# EAGLE design SENSORY_BRIDGE (EAGLE 9.5.1)
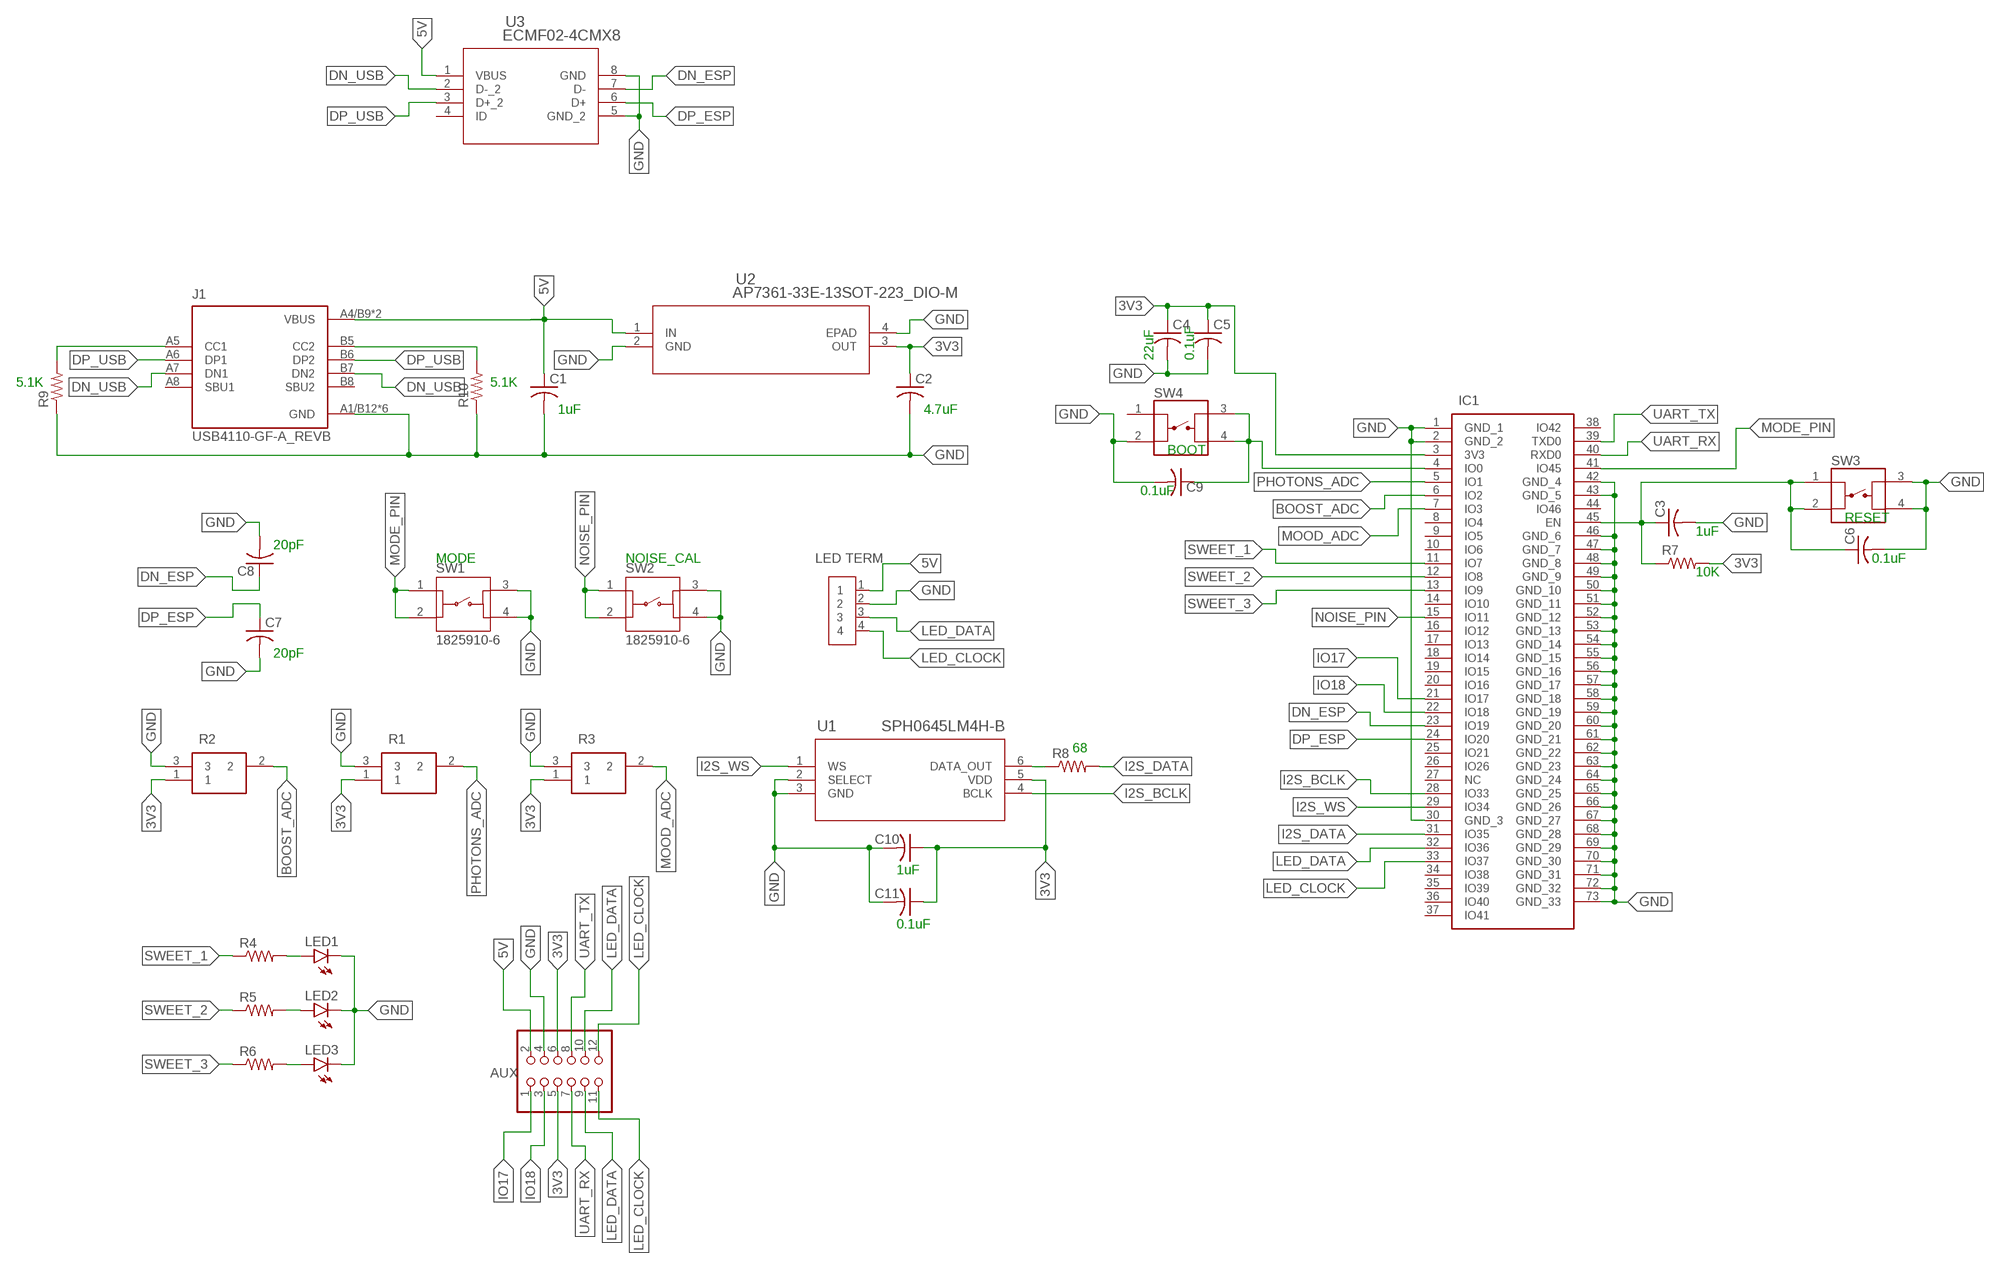
[diagram p0: schematic, sheet 1]

## Parts
C1  C-USC0805K  [C0805K]
C2  C-USC0805K  [C0805K]
C3  C-USC0805K  [C0805K]
C4  C-USC0805K  [C0805K]
C5  C-USC0805K  [C0805K]
C6  C-USC0805K  [C0805K]
C7  C-USC0805K  [C0805K]
C8  C-USC0805K  [C0805K]
C9  C-USC0805K  [C0805K]
C10  C-USC0805K  [C0805K]
C11  C-USC0805K  [C0805K]
IC1  ESP32-S2-MINI-1-N4R2  [ESP32S2MINI1N4R2]
J1  USB4110-GF-A_REVB  [GCT_USB4110-GF-A_REVB]
J2  796949-4  [TE_796949-4]
JP1  PINHD-2X6  [2X06]
LED1  LED3MM  [LED3MM]
LED2  LED3MM  [LED3MM]
LED3  LED3MM  [LED3MM]
R1  3386P-1-103LF  [3386P_1]
R2  3386P-1-103LF  [3386P_1]
R3  3386P-1-103LF  [3386P_1]
R4  R-US_R0805  [R0805]
R5  R-US_R0805  [R0805]
R6  R-US_R0805  [R0805]
R7  R-US_R0805  [R0805]
R8  R-US_R0805  [R0805]
R9  R-US_R0805  [R0805]
R10  R-US_R0805  [R0805]
SW1  1825910-6  [SW_1825910-6-4]
SW2  1825910-6  [SW_1825910-6-4]
SW3  PTS525SM15SMTR2LFS  [SW_PTS525SM15SMTR2LFS]
SW4  PTS525SM15SMTR2LFS  [SW_PTS525SM15SMTR2LFS]
U1  SPH0645LM4H-B  [SPH0645LM4H-B_KNO]
U2  AP7361-33E-13SOT-223_DIO-M  [SOT-223_DIO-M]
U3  ECMF02-4CMX8  [MICRO_QFN-8L_STM]

## Nets
3V3: C2.1 C4.1 C5.1 C10.1 C11.1 IC1.3(3V3) JP1.5 JP1.6 R1.1 R2.1 R3.1 R7.2 U1.5(VDD) U2.3(OUT)
5V: C1.1 J1.A4/B9(VBUS) J1.B4/A9(VBUS) J2.1 JP1.2 U2.1(IN) U3.1(VBUS)
BOOST_ADC: IC1.6(IO2) R2.2
BOOT_LINE: C9.1 IC1.4(IO0) SW4.3 SW4.4
CC1: J1.A5(CC1) R9.2
CC2: J1.B5(CC2) R10.2
DN_ESP: C8.1 IC1.23(IO19) U3.7(D-)
DN_USB: J1.A7(DN1) J1.B7(DN2) U3.2(D-_2)
DP_ESP: C7.1 IC1.24(IO20) U3.6(D+)
DP_USB: J1.A6(DP1) J1.B6(DP2) U3.3(D+_2)
GND: C1.2 C2.2 C3.2 C4.2 C5.2 C6.2 C7.2 C8.2 C9.2 C10.2 C11.2 IC1.1(GND_1) IC1.2(GND_2) IC1.30(GND_3) IC1.42(GND_4) IC1.43(GND_5) IC1.46(GND_6) IC1.47(GND_7) IC1.48(GND_8) IC1.49(GND_9) IC1.50(GND_10) IC1.51(GND_11) IC1.52(GND_12) IC1.53(GND_13) IC1.54(GND_14) IC1.55(GND_15) IC1.56(GND_16) IC1.57(GND_17) IC1.58(GND_18) IC1.59(GND_19) IC1.60(GND_20) IC1.61(GND_21) IC1.62(GND_22) IC1.63(GND_23) IC1.64(GND_24) IC1.65(GND_25) IC1.66(GND_26) IC1.67(GND_27) IC1.68(GND_28) IC1.69(GND_29) IC1.70(GND_30) IC1.71(GND_31) IC1.72(GND_32) IC1.73(GND_33) J1.A1/B12(GND) J1.B1/A12(GND) J1.S1(GND) J1.S2(GND) J1.S3(GND) J1.S4(GND) J2.2 JP1.4 LED1.K(C) LED2.K(C) LED3.K(C) R1.3 R2.3 R3.3 R9.1 R10.1 SW1.3 SW1.4 SW2.3 SW2.4 SW3.3 SW3.4 SW4.2 U1.2(SELECT) U1.3(GND) U2.2(GND) U2.4(EPAD) U3.5(GND_2) U3.8(GND)
I2S_BCLK: IC1.28(IO33) U1.4(BCLK)
I2S_DATA: IC1.31(IO35) R8.2
I2S_WS: IC1.29(IO34) U1.1(WS)
IO17: IC1.21(IO17) JP1.1
IO18: IC1.22(IO18) JP1.3
LED_CLOCK: IC1.33(IO37) J2.4 JP1.11 JP1.12
LED_DATA: IC1.32(IO36) J2.3 JP1.9 JP1.10
MODE_PIN: IC1.41(IO45) SW1.1 SW1.2
MOOD_ADC: IC1.7(IO3) R3.2
N$2: R8.1 U1.6(DATA_OUT)
N$4: LED1.A R4.2
N$5: LED2.A R5.2
N$6: LED3.A R6.2
NOISE_PIN: IC1.15(IO11) SW2.1 SW2.2
PHOTONS_ADC: IC1.5(IO1) R1.2
RESET_LINE: C3.1 C6.1 IC1.45(EN) R7.1 SW3.1 SW3.2
SWEET_1: IC1.11(IO7) R4.1
SWEET_2: IC1.12(IO8) R5.1
SWEET_3: IC1.13(IO9) R6.1
UART_RX: IC1.40(RXD0) JP1.7
UART_TX: IC1.39(TXD0) JP1.8
Unconnected: IC1.8(IO4) IC1.9(IO5) IC1.10(IO6) IC1.14(IO10) IC1.16(IO12) IC1.17(IO13) IC1.18(IO14) IC1.19(IO15) IC1.20(IO16) IC1.25(IO21) IC1.26(IO26) IC1.27(NC) IC1.34(IO38) IC1.35(IO39) IC1.36(IO40) IC1.37(IO41) IC1.38(IO42) IC1.44(IO46) J1.A8(SBU1) J1.B8(SBU2) SW4.1 U3.4(ID)

## Notes on the sheet
- 22uF | 0.1uF
- 5.1K | 5.1K
- 1uF | 4.7uF
- BOOT
- 0.1uF
- RESET
- 1uF
- 20pF
- MODE | NOISE_CAL | LED TERM | 0.1uF
- 10K
- 20pF
- 68
- 1uF
- 0.1uF
- AUX

## Library data of the parts
C1-C11 = adafruit:C-US: CAPACITOR, American symbol
IC1 = SamacSys_Parts:ESP32-S2-MINI-1-N4R2: WiFi Modules - 802.11 SMD module, ESP32-S2FN4R2 with 4 MB flash die and 2 MB PSRAM die inside, PCB antenna Source: Datasheet; DESCRIPTION: WiFi Modules - 802.11 SMD module, ESP32-S2FN4R2 with 4 MB flash die and 2 MB PSRAM die inside, PCB antenna; HEIGHT: 2.55mm; MANUFACTURER_NAME: Espressif Systems; MANUFACTURER_PART_NUMBER: ESP32-S2-MINI-1-N4R2; MOUSER_PART_NUMBER: 356-ESP32S2MINI1N4R2; MOUSER_PRICE-STOCK: https://www.mouser.co.uk/ProductDetail/Espressif-Systems/ESP32-S2-MINI-1-N4R2?qs=iLbezkQI%252Bsgb61FCBnw%252B9A%3D%3D
J1 = USB4110-GF-A_REVB:USB4110-GF-A_REVB; DESCRIPTION: USB-C (USB TYPE-C) USB 2.0 Receptacle Connector 24 (16+8 Dummy) Position Surface Mount, Right Angle; Through Hole; DIGI-KEY_PART_NUMBER: 2073-USB4110-GF-A-1-ND; MF: GCT; MP: USB4110-GF-A; PACKAGE: None; PURCHASE-URL: https://pricing.snapeda.com/search/part/USB4110-GF-A/?ref=eda
J2 = screw_terminal_796949-4:796949-4: Wire to Board 4 Position 5.08 mm Pitch 30-12 AWG Euro Style Terminal Block; COMMENT: 796949-4; DESCRIPTION: 4 Position Wire to Board Terminal Block Horizontal with Board 0.200 (5.08mm) Through Hole; DIGI-KEY_PART_NUMBER: 796949-4-ND; MF: TE Connectivity; MP: 796949-4; PACKAGE: None; PURCHASE-URL: https://pricing.snapeda.com/search/part/796949-4/?ref=eda
JP1 = pinhead:PINHD-2X6: PIN HEADER
LED1-LED3 = led_3mm_better:LED: LED OSRAM: - CHIPLED LG R971, LG N971, LY N971, LG Q971, LY Q971, LO R971, LY R971 LH N974, LH R974 LS Q976, LO Q976, LY Q976 LO Q996 - Hyper CHIPLED LW Q18S LB Q993, LB Q99A, LB R99A - SideLED LS A670, LO A670, LY A670, LG A670, LP A670 LB A673, LV A673, LT A673, LW A673 LH A674 LY A675 LS A676, LA A676, LO A676, LY A676, LW A676 LS A679, LY A679, LG A679 - Hyper Micro SIDELED® LS Y876, LA Y876, LO Y876, LY Y876 LT Y87S - SmartLED LW L88C, LW L88S LB L89C, LB L89S, LG L890 LS L89K, LO L89K, LY L89K LS L896, LA L896, LO L896, LY L896 - TOPLED LS T670, LO T670, LY T670, LG T670, LP T670 LSG T670, LSP T670, LSY T670, LOP T670, LYG T670 LG T671, LOG T671, LSG T671 LB T673, LV T673, LT T673, LW T673 LH T674 LS T676, LA T676, LO T676, LY T676, LB T676, LH T676, LSB T676, LW T676 LB T67C, LV T67C, LT T67C, LS T67K, LO T67K, LY T67K, LW E67C LS E67B, LA E67B, LO E67B, LY E67B, LB E67C, LV E67C, LT E67C LW T67C LS T679, LY T679, LG T679 LS T770, LO T770, LY T770, LG T770, LP T770 LB T773, LV T773, LT T773, LW T773 LH T774 LS E675, LA E675, LY E675, LS T675 LS T776, LA T776, LO T776, LY T776, LB T776 LHGB T686 LT T68C, LB T68C - Hyper Mini TOPLED® LB M676 - Mini TOPLED Santana® LG M470 LS M47K, LO M47K, LY M47K Source: http://www.osram.convergy.de LUXEON: - LUMILED® LXK2-PW12-R00, LXK2-PW12-S00, LXK2-PW14-U00, LXK2-PW14-V00 LXK2-PM12-R00, LXK2-PM12-S00, LXK2-PM14-U00 LXK2-PE12-Q00, LXK2-PE12-R00, LXK2-PE12-S00, LXK2-PE14-T00, LXK2-PE14-U00 LXK2-PB12-K00, LXK2-PB12-L00, LXK2-PB12-M00, LXK2-PB14-N00, LXK2-PB14-P00, LXK2-PB14-Q00 LXK2-PR12-L00, LXK2-PR12-M00, LXK2-PR14-Q00, LXK2-PR14-R00 LXK2-PD12-Q00, LXK2-PD12-R00, LXK2-PD12-S00 LXK2-PH12-R00, LXK2-PH12-S00 LXK2-PL12-P00, LXK2-PL12-Q00, LXK2-PL12-R00 Source: www.luxeon.com KINGBRIGHT: KA-3528ASYC Source: www.kingbright.com
R1-R3 = 3386P-1-103LF:3386P-1-103LF: Bourns 3386P Series Through Hole Trimmer Resistor with Pin Terminations, 10k +/-10% 1/2W +/-100ppm/C Top Adjust Source: Datasheet <https://www.bourns.com/pdfs/3386.pdf>; DESCRIPTION: Bourns 3386P Series Through Hole Trimmer Resistor with Pin Terminations, 10k +/-10% 1/2W +/-100ppm/C Top Adjust; HEIGHT: mm; MANUFACTURER_NAME: Bourns; MANUFACTURER_PART_NUMBER: 3386P-1-103LF; MOUSER_PART_NUMBER: 652-3386P-1-103LF; MOUSER_PRICE-STOCK: https://www.mouser.co.uk/ProductDetail/Bourns/3386P-1-103LF?qs=m2uG%2FFdTAPWTJ6kNGJOVuA%3D%3D
R4-R10 = adafruit:R-US_: RESISTOR, American symbol
SW1 SW2 = 6mm_tact_switch_1825910-6:1825910-6: Switch Tactile OFF (ON) SPST Round Button PC Pins 0.05A 24VDC 100000Cycles 1.57N Thru-Hole Loose; COMMENT: 1825910-6; DESCRIPTION: Switch Push Button OFF (ON) SPST Round Button 0.05A 24VDC Momentary Contact PC Pins Thru-Hole; DIGI-KEY_PART_NUMBER: 450-1650-ND; MF: TE Connectivity; MP: 1825910-6; PACKAGE: None; PURCHASE-URL: https://pricing.snapeda.com/search/part/1825910-6/?ref=eda
SW3 SW4 = PTS525SM15SMTR2LFS:PTS525SM15SMTR2LFS: Switch Tactile N.O. SPST Round Button Gull Wing 0.02A 15VDC 1000000Cycles 1.569N SMD T/R; DESCRIPTION: Tactile Switch SPST-NO Top Actuated Surface Mount; DIGI-KEY_PART_NUMBER: CKN9104CT-ND; MF: C&K; MP: PTS525SM15SMTR2 LFS; PACKAGE: Tactile Switch CK; PURCHASE-URL: https://pricing.snapeda.com/search/part/PTS525SM15SMTR2 LFS/?ref=eda
U1 = SPH0645LM4H-B:SPH0645LM4H-B; COPYRIGHT: Copyright (C) 2022 Ultra Librarian. All rights reserved.; DIGI-KEY_PART_NUMBER_1: 423-1405-2-ND; DIGI-KEY_PART_NUMBER_2: 423-1405-1-ND; DIGI-KEY_PART_NUMBER_3: 423-1405-6-ND; MANUFACTURER_PART_NUMBER: SPH0645LM4H-B; MFR_NAME: Knowles
U2 = 3V3_Regulator_AP7361-33E-13:AP7361-33E-13; COPYRIGHT: Copyright (C) 2022 Ultra Librarian. All rights reserved.; DIGI-KEY_PART_NUMBER_1: AP7361-33E-13DICT-ND; DIGI-KEY_PART_NUMBER_2: AP7361-33E-13DIDKR-ND; DIGI-KEY_PART_NUMBER_3: AP7361-33E-13DITR-ND; MANUFACTURER_PART_NUMBER: AP7361-33E-13; MFR_NAME: Diodes Inc
U3 = ECMF02-4CMX8_USB_ESD_IC:ECMF02-4CMX8; COPYRIGHT: Copyright (C) 2022 Ultra Librarian. All rights reserved.; DIGI-KEY_PART_NUMBER_1: 497-13420-2-ND; DIGI-KEY_PART_NUMBER_2: 497-13420-1-ND; DIGI-KEY_PART_NUMBER_3: 497-13420-6-ND; MANUFACTURER_PART_NUMBER: ECMF02-4CMX8; MFR_NAME: STMicroelectronics

## Board
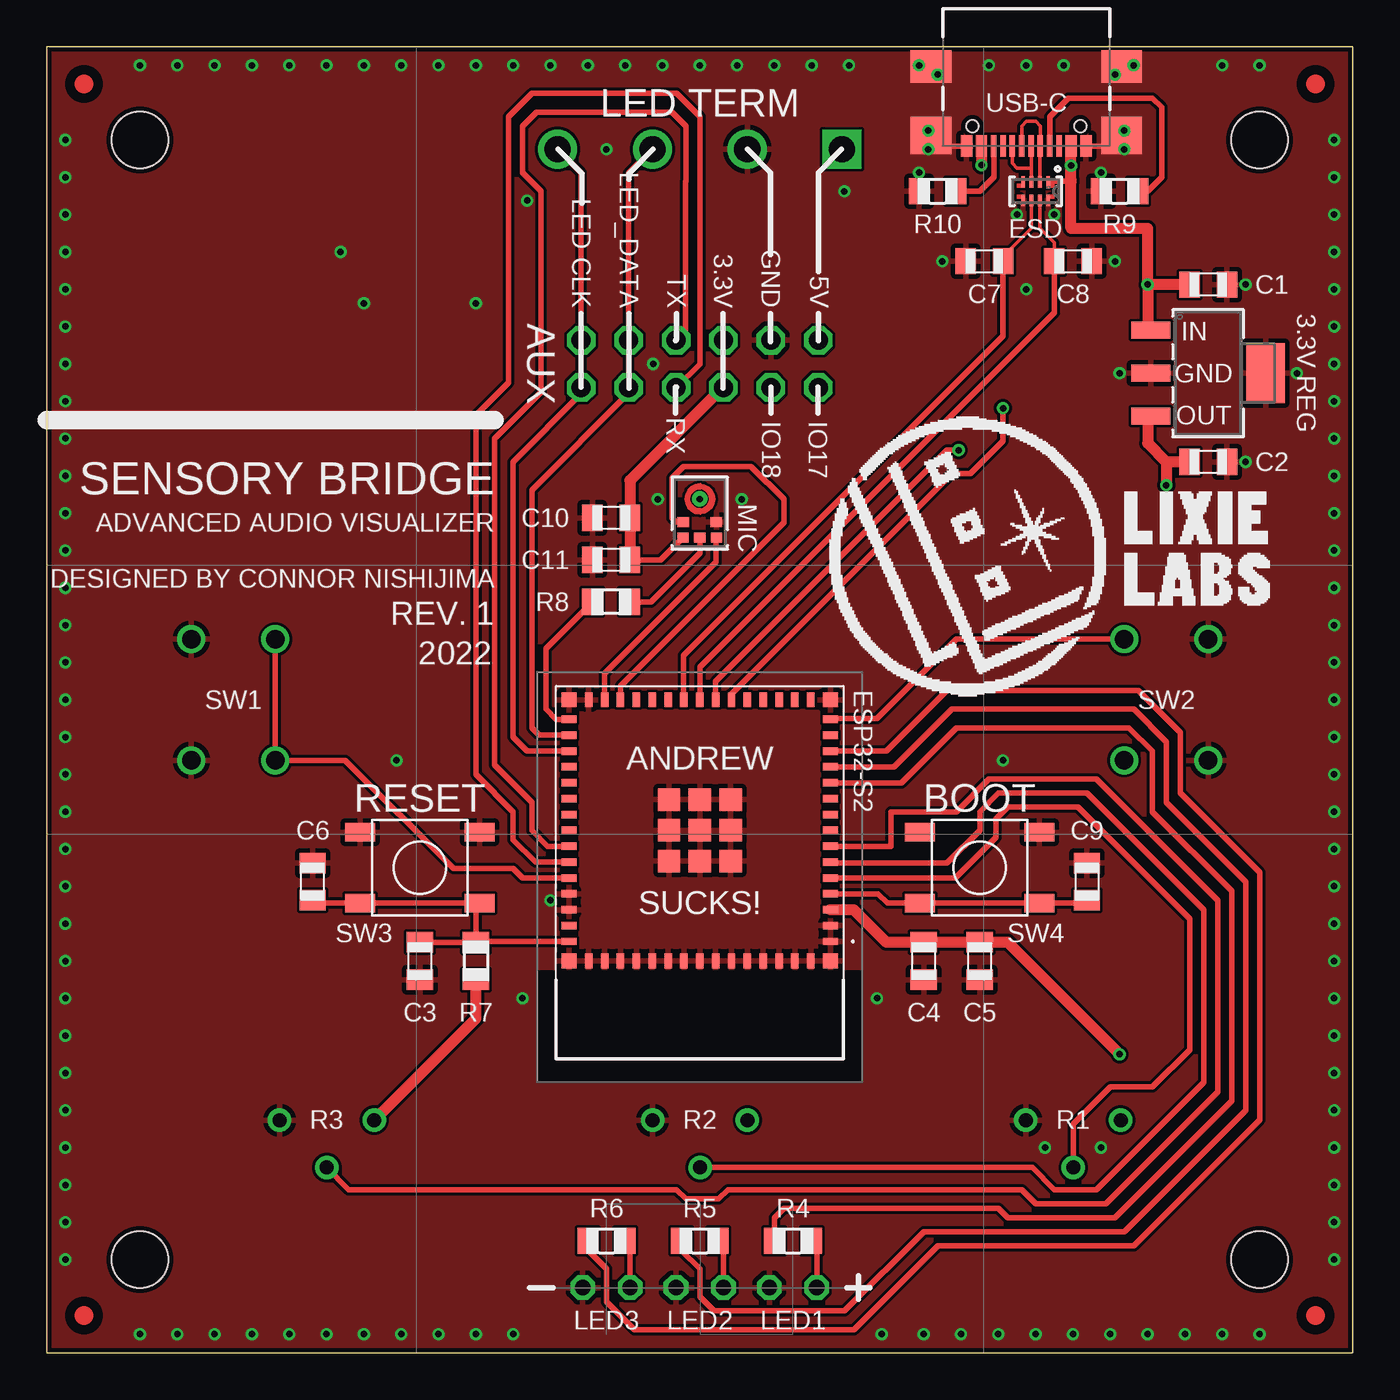
[diagram p1: board, top side]
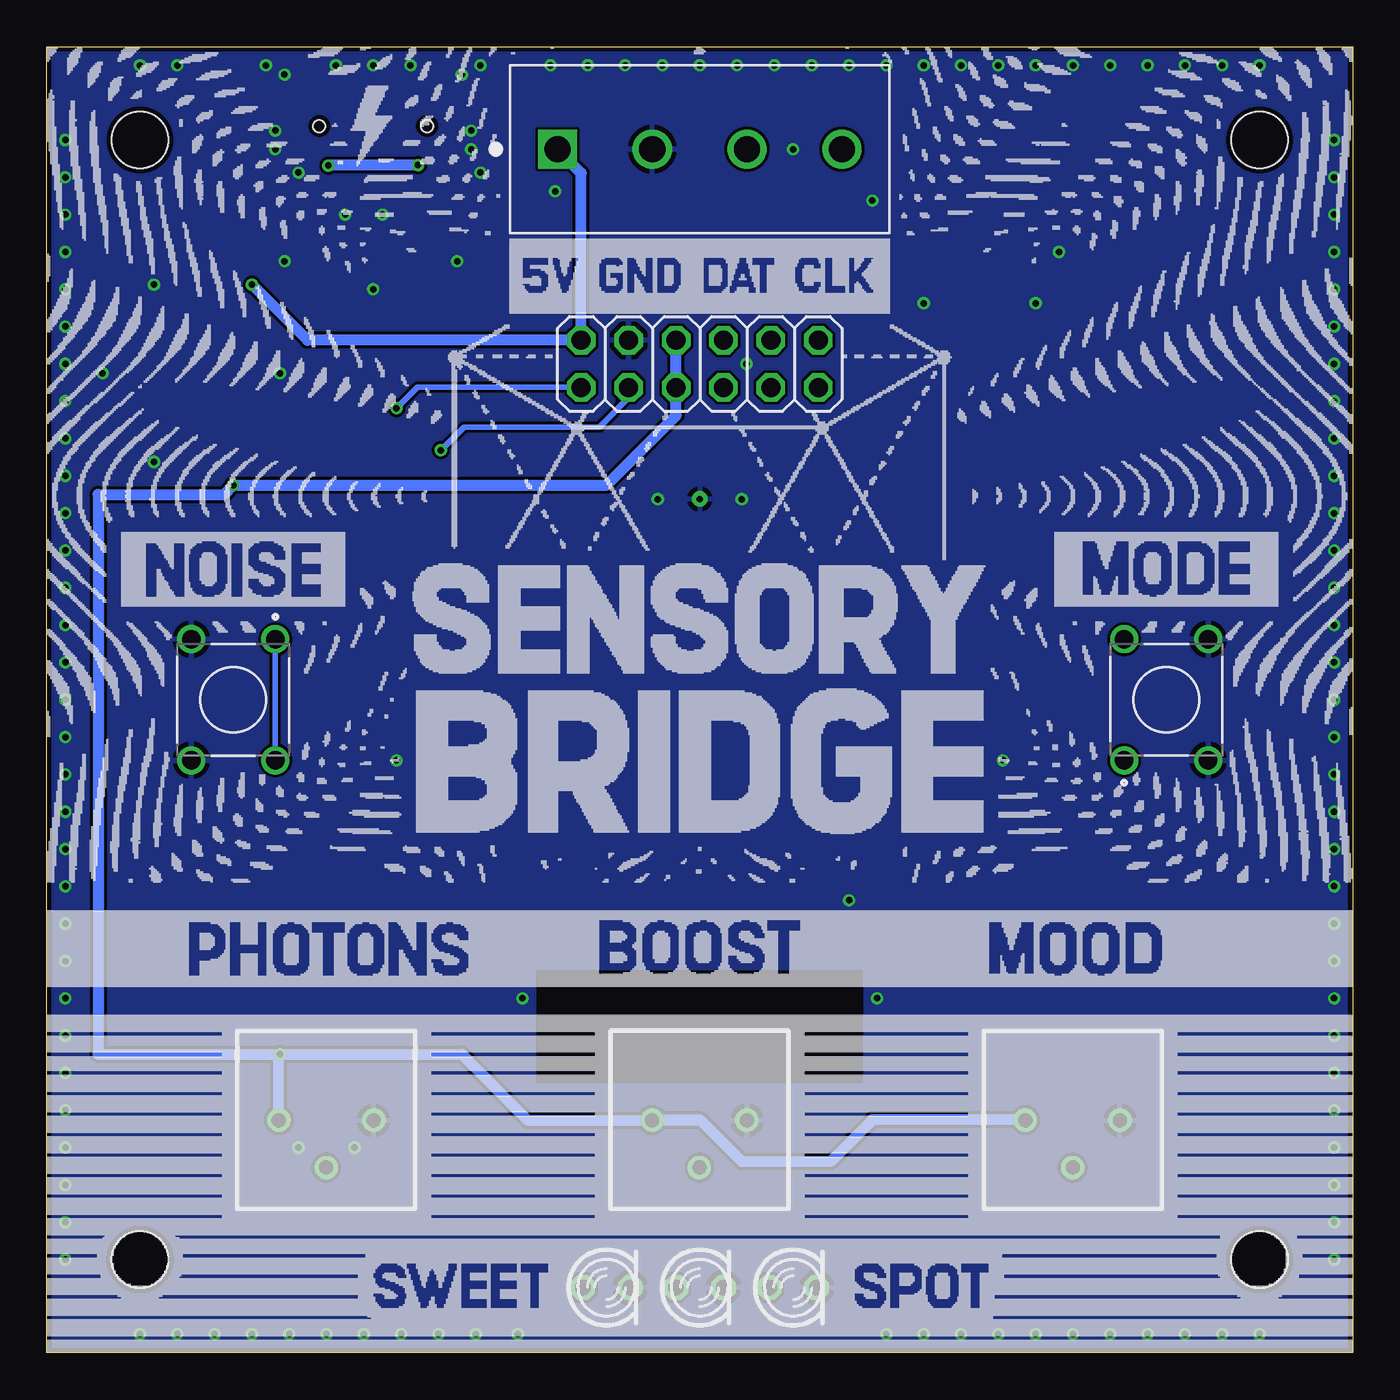
[diagram p2: board, bottom side, seen from below]

Size 70 x 70 mm. Coordinates in mm from the lower left corner, seen from the top.
Outline: 0,0 70,0 70,70 0,70 0,0
Copper layers (1*16): Top 0.035mm / dielectric 1.5mm / Bottom 0.035mm
Design rules "dirt_cheap_dirty_boards.v1.1": minimum track width 6mil, minimum drill 12mil, track to track 6mil, track to pad 6mil, pad to pad 6mil, via to via 6mil, smd to smd 0mil, copper to edge 10mil, drill to drill 10mil, minimum pad ring 10mil, minimum via ring 6mil, stop-mask expansion 2mil, vias tented up to drill 25mil, thermal gap 10mil
Holes 3.05 mm at 5,65 65,65 5,5 65,5
tRestrict: area 26.2,14.5 to 43.8,20.5
bRestrict: area 26.2,14.5 to 43.8,20.5

### Footprints (pad centres in the part's own frame; a part is rotated, then mirrored left to right if it is on the bottom)
C0805K = smd 1.1 x 1.4: 1 -1,0; 2 1,0
ESP32S2MINI1N4R2 = smd 0.8 x 0.4: 1 -7,5.95; 2 -7,5.1; 3 -7,4.25; 4 -7,3.4; 5 -7,2.55; 6 -7,1.7; 7 -7,0.85; 8 -7,0; 9 -7,-0.85; 10 -7,-1.7; 11 -7,-2.55; 12 -7,-3.4; 13 -7,-4.25; 14 -7,-5.1; 15 -7,-5.95; 31 7,-5.95; 32 7,-5.1; 33 7,-4.25; 34 7,-3.4; 35 7,-2.55; 36 7,-1.7; 37 7,-0.85; 38 7,0; 39 7,0.85; 40 7,1.7; 41 7,2.55; 42 7,3.4; 43 7,4.25; 44 7,5.1; 45 7,5.95 | smd 0.4 x 0.8: 16 -5.95,-7; 17 -5.1,-7; 18 -4.25,-7; 19 -3.4,-7; 20 -2.55,-7; 21 -1.7,-7; 22 -0.85,-7; 23 0,-7; 24 0.85,-7; 25 1.7,-7; 26 2.55,-7; 27 3.4,-7; 28 4.25,-7; 29 5.1,-7; 30 5.95,-7; 46 5.95,7; 47 5.1,7; 48 4.25,7; 49 3.4,7; 50 2.55,7; 51 1.7,7; 52 0.85,7; 53 0,7; 54 -0.85,7; 55 -1.7,7; 56 -2.55,7; 57 -3.4,7; 58 -4.25,7; 59 -5.1,7; 60 -5.95,7 | smd 1.2 x 1.2: 61 0,0; 66 -1.65,1.65; 67 -1.65,0; 68 -1.65,-1.65; 69 0,-1.65; 70 1.65,-1.65; 71 1.65,0; 72 1.65,1.65; 73 0,1.65 | smd 0.8 x 0.8: 62 -7,7; 63 -7,-7; 64 7,-7; 65 7,7
GCT_USB4110-GF-A_REVB = smd 0.6 x 1.15: A1/B12 -3.2,1.075; A4/B9 -2.4,1.075; B1/A12 3.2,1.075; B4/A9 2.4,1.075 | smd 0.3 x 1.15: A5 -1.25,1.075; A6 -0.25,1.075; A7 0.25,1.075; A8 1.25,1.075; B5 1.75,1.075; B6 0.75,1.075; B7 -0.75,1.075; B8 -1.75,1.075 | smd 2.18 x 2: S1 -5.11,0.5; S2 5.11,0.5 | smd 2.18 x 1.75: S3 -5.11,-3.18; S4 5.11,-3.18 | hole 0.65: -2.89,0; 2.89,0
TE_796949-4 = drill 1.4 square: 1 0,0 | drill 1.4: 2 5.08,0; 3 10.16,0; 4 15.24,0
2X06 = drill 1.016 octagon: 1 -6.35,-1.27; 2 -6.35,1.27; 3 -3.81,-1.27; 4 -3.81,1.27; 5 -1.27,-1.27; 6 -1.27,1.27; 7 1.27,-1.27; 8 1.27,1.27; 9 3.81,-1.27; 10 3.81,1.27; 11 6.35,-1.27; 12 6.35,1.27
LED3MM = drill 0.813 octagon: A -1.27,0; K 1.27,0
3386P_1 = drill 0.75 pad 1.25: 1 7.305,4.78; 2 4.765,7.32; 3 2.225,4.78
R0805 = smd 1.1 x 1.4: 1 -1,0; 2 1,0
SW_1825910-6-4 = drill 0.99: 1 -3.25,2.25; 2 3.25,2.25; 3 -3.25,-2.25; 4 3.25,-2.25
SW_PTS525SM15SMTR2LFS = smd 1.6 x 1: 1 -3.2,1.9; 2 3.2,1.9; 3 -3.2,-1.9; 4 3.2,-1.9
SPH0645LM4H-B_KNO = smd 0.533 x 0.61: 1 1.311,0.9; 2 0.489,0.889; 4 0.489,-0.889; 5 1.311,-0.9; 6 1.311,0 | drill 0.33 pad 0.33: 3 -0.762,0
SOT-223_DIO-M = smd 0.902 x 2.066: 1 -2.3,-3.076; 2 0,-3.076; 3 2.3,-3.076 | smd 3.202 x 2.066: 4 0,3.076
MICRO_QFN-8L_STM = smd 0.61 x 0.203: 1 -0.5,0.675; 2 -0.5,0.225; 3 -0.5,-0.225; 4 -0.5,-0.675; 5 0.5,-0.675; 6 0.5,-0.225; 7 0.5,0.225; 8 0.5,0.675

### Placement (x,y rotation side)
C1  62.25,57.25 0 top
C2  62.25,47.75 0 top
C3  20,21 270 top
C4  47,21 270 top
C5  50,21 270 top
C6  14.25,25.25 90 top
C7  50.25,58.5 180 top
C8  55,58.5 0 top
C9  55.75,25.25 90 top
C10  30.25,44.75 180 top
C11  30.25,42.5 180 top
IC1  35,28 180 top
J1  52.5,65.75 180 top
J2  42.62,64.5 0 bottom
JP1  35,53 0 bottom
LED1  40,3.5 0 bottom
LED2  35,3.5 0 bottom
LED3  30,3.5 0 bottom
R1  50.25,17.25 180 bottom
R2  30.25,17.25 180 bottom
R3  10.25,17.25 180 bottom
R4  40,6 0 top
R5  35,6 0 top
R6  30,6 0 top
R7  23,21 270 top
R8  30.25,40.25 180 top
R9  57.5,62.25 0 top
R10  47.75,62.25 0 top
SW1  10,35 90 bottom
SW2  60,35 270 bottom
SW3  20,26 180 top
SW4  50,26 0 top
U1  35,45 270 top
U2  62.25,52.5 270 top
U3  53,62.25 270 top
U$1  [CIRCLE-1MM-2R]  2,68 0 top
U$2  [CIRCLE-1MM-2R]  68,68 0 top
U$3  [CIRCLE-1MM-2R]  2,2 0 top
U$4  [CIRCLE-1MM-2R]  68,2 0 top

### Tracks (layer width: path | path; a pad name or v marks a point on that pad's centre or on a via)
3V3  (via drill 0.35 pad 0.6)
  Top 0.3: U1.5 32.91,42.5 C11.1
  Top 0.6: C2.1 60,47.75 | 60,47.75 59,48.75 59,50.03 U2.3 | 60,47.75 v60,46.5 | IC1.3 43.25,23.75 45,22 C4.1 C5.1 51.5,22 v57.5,16 | JP1.5 36.23,51.73 31.25,46.75 C10.1 C11.1 | R3.1 23,17.91 R7.2
  Bottom 0.6: R1.1 57.55,15.97 57.52,16 | 57.52,16 67.25,16 67.25,46 60.5,46 v60,46.5 40,46.5 36.27,50.23 JP1.5 JP1.6 | 57.52,16 v57.5,16 47.75,16 44.22,12.47 R2.1 34.97,12.47 32.75,10.25 28,10.25 25.75,12.5 17.55,12.5 R3.1
5V  (via drill 0.35)
  Top 0.2: 54.9,62.75 U3.1 53.77,62.85 54.9,62.85
  Top 0.6: J1.B4/A9 v50.1,63.65 | v59,57.25 59,54.8 U2.1 | C1.1 v59,57.25 | v59,57.25 59,60.25 54.9,60.25 54.9,62.75 54.9,62.85 v54.9,63.62 J1.A4/B9
  Bottom 0.6: J2.1 41.35,63.23 JP1.2 56.02,54.27 v59,57.25 | v50.1,63.65 54.88,63.65 54.88,63.62 v54.9,63.62
BOOST_ADC
  Top 0.3: IC1.6 42.05,26.25 48.25,26.25 50,28 50,29 51,30 55.75,30 62,23.75 62,14.5 56.25,8.75 54,8.75 52.82,9.93 R2.2
BOOT_LINE
  Top 0.3: IC1.4 44.55,24.6 45.05,24.1 SW4.3 SW4.4 55.6,24.1 C9.1
CC1
  Top 0.3: J1.A5 53.75,66.25 54.75,67.25 59.25,67.25 59.75,66.75 59.75,63 59,62.25 R9.2
CC2
  Top 0.3: J1.B5 50.75,63 50,62.25 R10.2
DN_ESP
  Top 0.2: U3.7 53.23,60.27 54,59.5 C8.1
  Top 0.3: IC1.23 35,36.75 54,55.75 C8.1
DN_USB
  Top 0.2: J1.A7 52.25,65.75 52.5,66 53,66 53.25,65.75 J1.B7 53.23,64.65 U3.2
DP_ESP
  Top 0.2: U3.6 52.77,60.27 51.25,58.75 C7.1
  Top 0.3: IC1.24 34.12,35.02 34.12,37.38 51.25,54.5 C7.1
DP_USB
  Top 0.2: J1.B6 51.75,63.75 52,63.5 52.77,63.5 | J1.A6 52.77,64.65 52.77,63.5 | 52.77,63.5 U3.3
GND  (via drill 0.35, 0.35 pad 0.6)
  Top 0.3: J1.B1/A12 47.97,64.67 J1.S2 | J1.A1/B12 57.03,64.67 J1.S1
  other vias: 32.75,45.75 37.25,45.75 18.75,31.75 51.25,31.75 46.75,69 47.75,68.5 47.25,65.5 47.25,64.5 57.75,64.5 57.75,65.5 57.25,68.5 58.25,69 15.75,59 17,56.25 23,56.25 32.5,53 42.75,62.25 52.5,57 30,64.5 25.75,61.75 46.75,63.25 56.5,63.25 52,61 54,61 64.25,57.25 64.25,47.75 48,58.5 57.25,58.5 57.5,52.5 67,52.5 27,24.25 5,69 7,69 9,69 11,69 13,69 15,69 17,69 19,69 21,69 23,69 25,69 27,69 29,69 31,69 33,69 35,69 37,69 39,69 41,69 43,69 50.5,69 52.5,69 54.5,69 63,69 65,69 69,65 69,63 69,61 69,59 69,57 69,55 69,53 69,51 69,49 69,47 69,45 69,43 69,41 69,39 69,37 69,35 69,33 69,31 69,29 69,27 69,25 69,23 69,21 69,19 69,17 69,15 69,13 69,11 69,9 69,7 69,5 44.75,1 5,1 7,1 9,1 11,1 13,1 15,1 17,1 19,1 21,1 23,1 25,1 47,1 49,1 51,1 53,1 59,1 61,1 63,1 65,1 57,1 55,1 1,65 1,63 1,61 1,59 1,57 1,55 1,53 1,51 1,49 1,47 1,45 1,43 1,41 1,39 1,37 1,35 1,33 1,31 1,29 1,27 1,25 1,23 1,21 1,19 1,17 1,15 1,13 1,11 1,9 1,7 1,5 25.5,19 44.5,19 56.5,11 53.5,11
  pour Top: -1,-1 -1,71 71,71 71,-1
  pour Bottom: -1,-1 71,-1 71,71 -1,71
I2S_BCLK
  Top 0.3: U1.4 33.74,44.51 33.5,44.75 33.5,46.88 34.12,47.5 37.75,47.5 39.5,45.75 39.5,44.5 30.75,35.75 IC1.28
I2S_DATA
  Top 0.3: IC1.31 27.3,33.95 26.75,34.5 26.75,37.75 R8.2
I2S_WS
  Top 0.3: U1.1 35.88,43.66 35.88,42.38 29.9,36.4 IC1.29
IO17  (via drill 0.35 pad 0.6)
  Top 0.3: IC1.21 36.73,35.02 36.69,35.06 36.69,35.31 48.5,47.12 49.5,47.12 51.25,48.88 v51.25,50.62
  Bottom 0.3: v51.25,50.62 50.12,51.75 41.37,51.75 JP1.1
IO18  (via drill 0.35 pad 0.6)
  Top 0.3: IC1.22 35.85,35.98 48.25,48.38 v48.88,48.38
  Bottom 0.3: v48.88,48.38 47.62,49.62 40.38,49.62 38.81,51.19 JP1.3
LED_CLOCK
  Top 0.3: J2.4 28.65,63.23 JP1.12 JP1.11 28.65,51.4 25,47.75 25,33 25.75,32.25 IC1.33
LED_DATA
  Top 0.3: J2.3 31.19,63.23 JP1.10 JP1.9 31.19,51.44 26,46.25 26,33.5 26.4,33.1 IC1.32
MODE_PIN
  Top 0.3: IC1.41 25.5,25.45 25,25.95 21.8,25.95 16,31.75 SW1.1 SW1.2
MOOD_ADC
  Top 0.3: IC1.7 45.25,27.15 45.25,29 48.75,29 50.5,30.75 56.25,30.75 62.75,24.25 62.75,14 56.75,8 53,8 52.25,8.75 36.5,8.75 36,8.25 34.25,8.25 33.75,8.75 16.2,8.75 R3.2
N$2
  Top 0.3: U1.6 35,42.88 32.38,40.25 R8.1
N$4
  Top 0.3: LED1.A 41.27,5.73 R4.2
N$5
  Top 0.3: LED2.A 36.27,5.73 R5.2
N$6
  Top 0.3: LED3.A 31.27,5.73 R6.2
NOISE_PIN
  Top 0.3: IC1.15 42.05,34 44.5,34 48.75,38.25 SW2.1
  Bottom 0.3: SW2.2 SW2.1
PHOTONS_ADC
  Top 0.3: IC1.5 48.7,25.45 50.88,27.62 50.88,28.62 51.5,29.25 55.25,29.25 61.25,23.25 61.25,16.25 59.25,14.25 57,14.25 55.02,12.27 R1.2
RESET_LINE
  Top 0.3: IC1.45 23.05,22.05 R7.1 | R7.1 C3.1 | R7.1 23,23.9 SW3.1 SW3.2 14.4,24.1 C6.1
SWEET_1
  Top 0.3: IC1.11 45.8,30.55 48.75,33.5 58,33.5 59.25,32.25 59.25,29 63.5,24.75 63.5,13.5 57.25,7.25 51.5,7.25 51,7.75 39.5,7.75 39,7.25 R4.1
SWEET_2
  Top 0.3: IC1.12 45.4,31.4 48.5,34.5 58.25,34.5 60,32.75 60,29.5 64.25,25.25 64.25,13 57.75,6.5 47,6.5 42.75,2.25 35.75,2.25 35,3 35,4.5 34,5.5 R5.1
SWEET_3
  Top 0.3: IC1.13 45,32.25 48.25,35.5 58.5,35.5 60.75,33.25 60.75,30 65,25.75 65,12.5 58.25,5.75 47.75,5.75 43.25,1.25 31.5,1.25 30,2.75 30,4.5 29,5.5 R6.1
UART_RX
  Top 0.3: JP1.7 35,53 35,66.25 33.75,67.5 26,67.5 24.75,66.25 24.75,52 23,50.25 23,31 25,29 25,27.5 26.2,26.3 IC1.40
UART_TX
  Top 0.3: IC1.39 26.85,27.15 26,28 26,29.5 24,31.5 24,49 26.5,51.5 26.5,62.25 25.5,63.25 25.5,65.75 26.25,66.5 33.5,66.5 34.25,65.75 34.25,62.79 34.23,62.77 34.23,54.77 JP1.8

### Text on the board
tPlace: LED TERM | AUX | SENSORY BRIDGE | ADVANCED AUDIO VISUALIZER | DESIGNED BY CONNOR NISHIJIMA | REV. 1 | 2022 | ANDREW | SUCKS!
tNames: USB-C | R10 | ESD | R9 | C1 | LED CLK | LED_DATA | TX | 3.3V | GND | 5V | C7 | C8 | IN | GND | 3.3V REG | OUT | RX | IO18 | IO17 | C2 | C10 | MIC | C11 | R8 | SW1 | SW2 | ESP32-S2 | RESET | BOOT | C6 | C9 | SW3 | SW4 | C3 | R7 | C4 | C5 | R3 | R2 | R1 | R6 | R5 | R4 | LED3 | LED2 | LED1